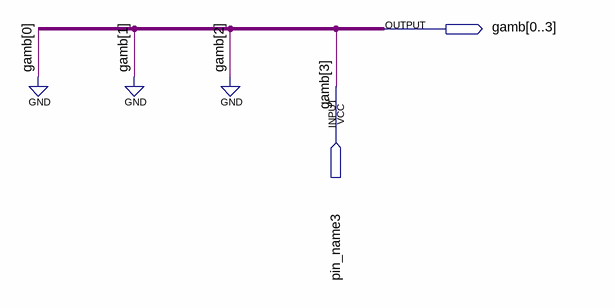
[diagram p0: schematic sheet]
// Quartus schematic gamb2.bdf as structural Verilog: 0 symbols, 2 pins
module gamb2 (
  input  pin_name3,
  output [0:3] gamb
);


  assign gamb = {3'b000, pin_name3};
endmodule
